# Altium project Dumber.PrjPCB
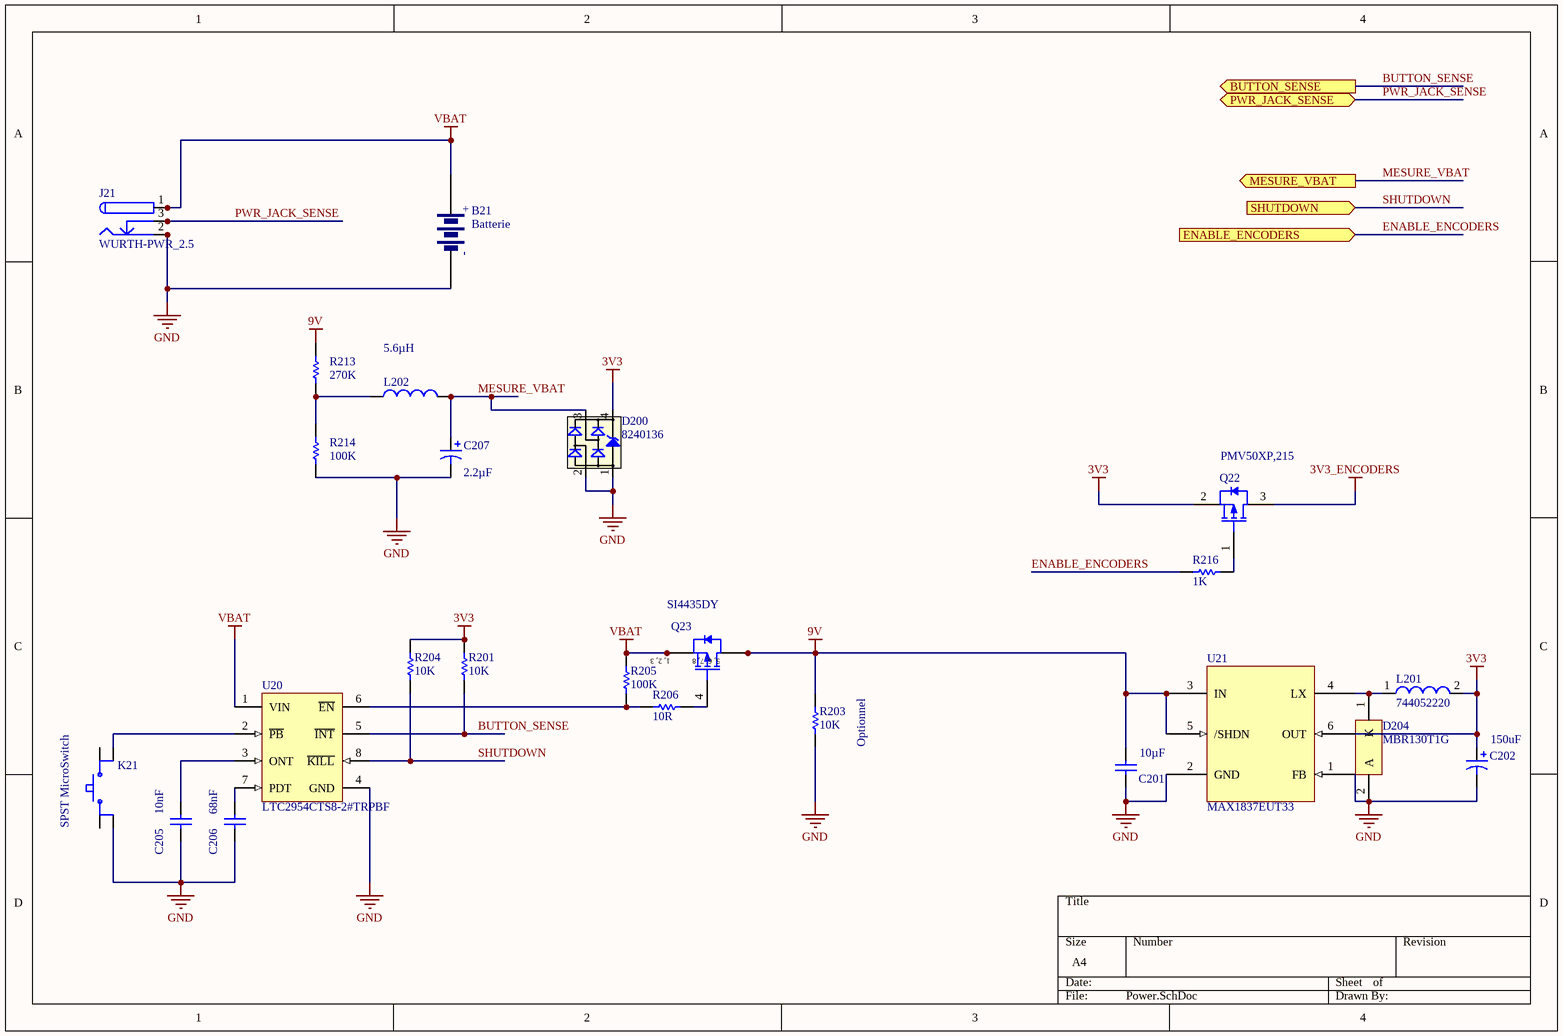
[diagram p0: Power.SchDoc]
2 sheets, 41 parts. Net scope: flat (ports and power ports of the same name join across sheets).
Board file: Dumber.PcbDoc
Sheets:
  Power.SchDoc
  cpu.SchDoc

## Sheet Power.SchDoc
size A4

### Parts
B21  Batterie  [batterie]
C201  value 10µF  [CAPC1206(3216)100_L]  (hidden comment: CAP 10µF)
C202  value 150uF  [B]  (hidden comment: CAP 150µF)
C205  value 10nF  [CAPC1206(3216)170_L]  (hidden comment: CAP 10nf)
C206  value 68nF  [CAPC1206(3216)170_L]  (hidden comment: CAP 68nF)
C207  value 2.2µF  [B]  (hidden comment: T491B)
D200  8240136  [SOT143-4L]
D204  MBR130T1G  [ONSC-SOD-123-2-425-04_V]
J21  WURTH-PWR_2.5  [Wurth_2.5]
K21  SPST MicroSwitch  [SPST_MicroSwitch]
L201  744052220  [WE-TPC-5818-L]
L202  value 5.6µH  [1812]  (hidden comment: Inductor)
Q22  PMV50XP,215  [NXP-SOT23_N]
Q23  SI4435DY  [SO-8_N]
R201  10K  [RESC1206(3216)_M]
R203  10K  [RESC1206(3216)_M]
R204  value 10K  [RESC1206(3216)_M]  (hidden comment: 100K)
R205  value 100K  [RESC1206(3216)_M]  (hidden comment: 270K)
R206  value 10R  [RESC1206(3216)_M]  (hidden comment: 270K)
R213  value 270K  [RESC0805(2012)_M]  (hidden comment: 270K 5% 0805(2012))
R214  100K  [RESC1206(3216)_M]
R216  1K  [RESC1206(3216)_M]
U20  LTC2954CTS8-2#TRPBF  [LT-TS8-8-TSOT-23_V]
U21  MAX1837EUT33  [SOT23-6]

### Ports
BUTTON_SENSE (out), ENABLE_ENCODERS (in), MESURE_VBAT (out), PWR_JACK_SENSE, SHUTDOWN (in)

### Nets
3V3: C202.1 D200.4(VDD) L201.2 Q22.2(S) R201.1 R204.1 U21.6(OUT)
3V3_ENCODERS: Q22.3(D)
9V: C201.2 Q23.5(D) Q23.6(D) Q23.7(D) Q23.8(D) R203.1 R213.2 U21.3(IN) U21.5(/SHDN)
GND: B21.V- C201.1 C202.2 C205.1 C206.1 C207.2 D200.1(GND) D200.2(I/O1) D204.2(A) J21.2 J21.2A J21.2B K21.2 R203.2 R214.2 U20.4(GND) U21.1(FB) U21.2(GND)
VBAT: B21.V+ J21.1 J21.1A J21.1B Q23.1(S) Q23.2(S) Q23.3(S) R205.1 U20.1(VIN)
BUTTON_SENSE: R201.2 U20.5(~{INT}) ; port BUTTON_SENSE
ENABLE_ENCODERS: R216.2 ; port ENABLE_ENCODERS
MESURE_VBAT: C207.1 D200.3(I/O2) L202.2 ; port MESURE_VBAT
PWR_JACK_SENSE: J21.3 J21.3A J21.3B ; port PWR_JACK_SENSE
SHUTDOWN: R204.2 U20.8(~{KILL}) ; port SHUTDOWN
NetC205_2: C205.2 U20.3(ONT)
NetC206_2: C206.2 U20.7(PDT)
NetD204_1: D204.1(K) L201.1 U21.4(LX)
NetK21_4: K21.4 U20.2(~{PB})
NetL202_1: L202.1 R213.1 R214.1
NetQ22_1: Q22.1(G) R216.1
NetQ23_4: Q23.4(G) R206.1
NetR205_2: R205.2 R206.2 U20.6(~{EN})

Not connected (* = marked no-connect by the designer): K21 1 3

### Notes on the sheet
- (near R203) Optionnel
- (in symbol Batterie) +; -
- (in symbol SI4435DY) 1, 2, 3; 5, 6, 7, 8

### Library data of the parts
B21 = Batterie: Keystone 1294; Distributeur: Radiospares: 172-5845 / Farnell: 1650674
C201 = CMP-1037-01131-1: CAP 10µF 25V ±10% 1206 (3216 Metric) Thickness 1mm SMD; Case-EIA: 1206; Tolerance: Â±10%; Case-Metric: 3216; Max Thickness: 1 mm; Technology: SMT; Rated Voltage: 25 V; Distributeur: Farnell : 2497120
C202 = 194D225X0015B2: CAP Tantalum, Body B, 150µF / 6.3V; Note: See Data Sheet for full range of components; Published: 19-Mar-2004; DatasheetDocument: 05-Jul-2002; PackageReference: B; Publisher: Altium Limited; ComponentLink1Description: Manufacturer Link; ComponentLink1URL: http://www.vishay.com/; ComponentLink2Description: Datasheet; ComponentLink2URL: http://www.vishay.com/docs/40000/194d.pdf; Distributeur: Farnell : 2491485
C205 C206 = CMP-1037-04201-1: CAP 100nF 50V ±10% 1206 (3216 Metric) Thickness 1.7mm SMD; Case-Metric: 3216; Tolerance: Â±10%; Case-EIA: 1206; Max Thickness: 1.7 mm; Rated Voltage: 50 V; Technology: SMT
  C205: Distributeur: Farnell : 1856586
  C206: Distributeur: Farnell : 2497117
C207 = T491B: Solid Tantalum Chip Capacitor, Standard T491 Series - Industrial Grade; Published: 17-Jul-2002; LatestRevisionDate: 19-Mar-2004; LatestRevisionNote: Silkscreen dimensions re-sized.; DatasheetDocument: Mar-2001; PackageDocument: Mar-2001; PackageReference: B; Publisher: Altium Limited; Code_JEITA: 3528-21; ComponentLink1Description: Manufacturer Link; ComponentLink1URL: http://www.kemet.com/; ComponentLink2Description: Datasheet; ComponentLink2URL: http://www.kemet.com/kemet/web/homepage/kechome.nsf/vapubfilesname/F3102TA.pdf/$file/F3102TA.pdf
D200 = CMP-1486-00002-1: TVS Diode WE-TVS-HS, VRWM=3.3V; Manufacturer: Wuerth Elektronik; Reverse Stand Off Voltage: 3.3V; PartNumber: 8240136; ComponentLink1Description: Manufacturer URL; PackageReference: SOT143-4L; ComponentLink1URL: http://www.we-online.com; ComponentLink2Description: Datasheet; ComponentLink2URL: http://katalog.we-online.de/kataloge/eisos/media/pdf/8240136.pdf
D204 = CMP-1055-00423-1: Schottky Power Rectifier, 2-Pin SOD-123, Pb-Free, Tape and Reel; Manufacturer: On Semiconductor; IFSM Max (A): 5.5; Configuration: Single; Mounting Technology: Surface Mount; ComponentLink3Description: Package Specification; PartNumber: MBR130T1G; PackageDescription: 2-Pin SOD, Body 1.6 x 2.69 mm; ComponentLink2Description: Datasheet; ComponentLink1Description: Manufacturer URL; Packing: Tape and Reel; PackageVersion: Rev. G, 10/2009; DatasheetVersion: Rev. 4; ComponentLink1URL: http://www.onsemi.com/; ComponentLink2URL: http://www.onsemi.cn/pub_link/Collateral/MBR130T1-D.PDF; PackageReference: SOD-123-2-425-04; ComponentLink3URL: http://www.onsemi.com/pub_link/Collateral/425-04.PDF; RoHS: TRUE; Distributeur: Farnell : 1431045
J21 = WURTH-PWR_2.5: Low Voltage Power Supply Connector; Published: 17-Dec-2003; DatasheetDocument: 09-May-2002; Publisher: Altium Limited; ComponentLink1Description: Manufacturer Link; ComponentLink1URL: http://domino.kycon.com/internet/Products.html; Distributeur: Farnell : 2472153
K21 = SPST MicroSwitch: SPST - MicroSwitch; Distributeur: Farnell: 2435161
L201 = CMP-0227-00400-1: SMD Shielded Tiny Power Inductor WE-TPC, L = 22.0 µH; Inductance: 22.0 ÂµH; DatasheetVersion: ver 7, Aug-2010; PackageReference: WE-TPC-5818-L; ComponentLink1URL: http://www.we-online.com; ComponentLink1Description: Manufacturer Link; ComponentLink2Description: Datasheet; PackageVersion: 2010; ComponentLink2URL: http://www.we-online.de/katalog/media/pdf/744052220.pdf; PackageDescription: SMD Inductor, 2-Leads, Body 5.8 x 5.8 mm; Distributeur: Farnell : 1635855
L202 = Inductor: Inductor SMD; Code_IEC: 1005; Published: 8-Jun-2000; LatestRevisionDate: 29-May-2009; LatestRevisionNote: IPC-7351 Footprint Added.; PackageReference: 0402-A; Publisher: Altium Limited; PackageDescription: Chip Inductor; Code_JEITA: 0402
Q22 = CMP-1258-00162-1: Single P-Channel Trench MOSFET, -20 V, -55 to 150 degC, 3-Pin SOT23, Tape and Reel; PartNumber: PMV65XP,215; Manufacturer: NXP Semiconductors; Ciss [typ] (pF): 744; Channel Type: P; Packing: Tape & Reel; Coss [typ] (pF): 65; VGSth [typ] (V): -0.65; ComponentLink3URL: http://www.nxp.com/documents/outline_drawing/sot023_po.pdf; Mounting Technology: Surface Mount; Code_JEDEC: TO-236AB; VDS [max] (V): -20; ComponentLink1URL: http://www.nxp.com/; ComponentLink2Description: Datasheet; ComponentLink3Description: Package Specification; PackageReference: SOT23; PackageVersion: 06-03-16, 03/2006; ComponentLink2URL: http://www.nxp.com/documents/data_sheet/PMV65XP.pdf; PackageDescription: 3-Pin Small Outline Transistor Package, Body 2.9 x 1.3 mm, Pitch 0.95 mm; DatasheetVersion: Rev. 2; ComponentLink1Description: Manufacturer URL; Distributeur: Farnell : 2498580
Q23 = SI4435DY: P-Channel 30V (D-S) Rated  MOSFET; Published: 8-Jun-2000; LatestRevisionDate: 13-Apr-2006; LatestRevisionNote: IPC-7351 Footprint Added.; DatasheetVersion: 6-Oct-1997; PackageVersion: Aug-1998; PackageReference: SO-8; Publisher: Altium Limited; PackageDescription: 8-Pin Small Outline Integrated Circuit 1.27 mm Pitch; ComponentLink1Description: Manufacturer Link; ComponentLink1URL: http://www.vishay.com/; ComponentLink2Description: Datasheet; ComponentLink2URL: http://www.vishay.com/docs/70149/70149.pdf
R201 R203-R206 R214 R216 = CMP-1014-00098-1: 10K 0.25W 5% 1206 (3216 Metric)  SMD; Case-Metric: 3216; Case-EIA: 1206; Power: 0.25 W; Tolerance: 5 %; Technology: SMT
  R201 R203: Value: 10K
  R214: Value: 100K
  R216: Value: 1K
R213 = CMP-1013-00132-1: 270K 0.125W 5% 0805 (2012 Metric)  SMD; Case-EIA: 0805; Case-Metric: 2012; Tolerance: 5 %; Technology: SMT; Power: 0.125 W
U20 = CMP-0482-01492-1: Pushbutton On / Off  Controller with µP Interrupt, 8-pin SOT23 (TS8-8), 0 to 70 degC, Pb-Free, Tape and Reel; Manufacturer: Linear Technology; Number of Supplies(#): 1; PackageDescription: 8-Pin Plastic TSOT-23, Body 2.9 x 1.63 mm, Pitch 0.65 mm; DatasheetVersion: Rev. B; ComponentLink1Description: Manufacturer URL; ComponentLink3Description: Package Specification; PackageVersion: Rev. A, 08/2010; RoHS: TRUE; ComponentLink2Description: Datasheet; Code_JEDEC: MO-193; ComponentLink2URL: http://cds.linear.com/docs/en/datasheet/2954fb.pdf; ComponentLink1URL: http://www.linear.com/; Packing: Tape and Reel; ComponentLink3URL: http://cds.linear.com/docs/en/packaging/SOT_8_05-08-1637.pdf; PackageReference: TS8-8; Mounting Technology: Surface Mount; PartNumber: LTC2954CTS8-2#TRPBF
U21 = MAX1837: Distributeur: Farnell : 2514159

## Sheet cpu.SchDoc
size A4
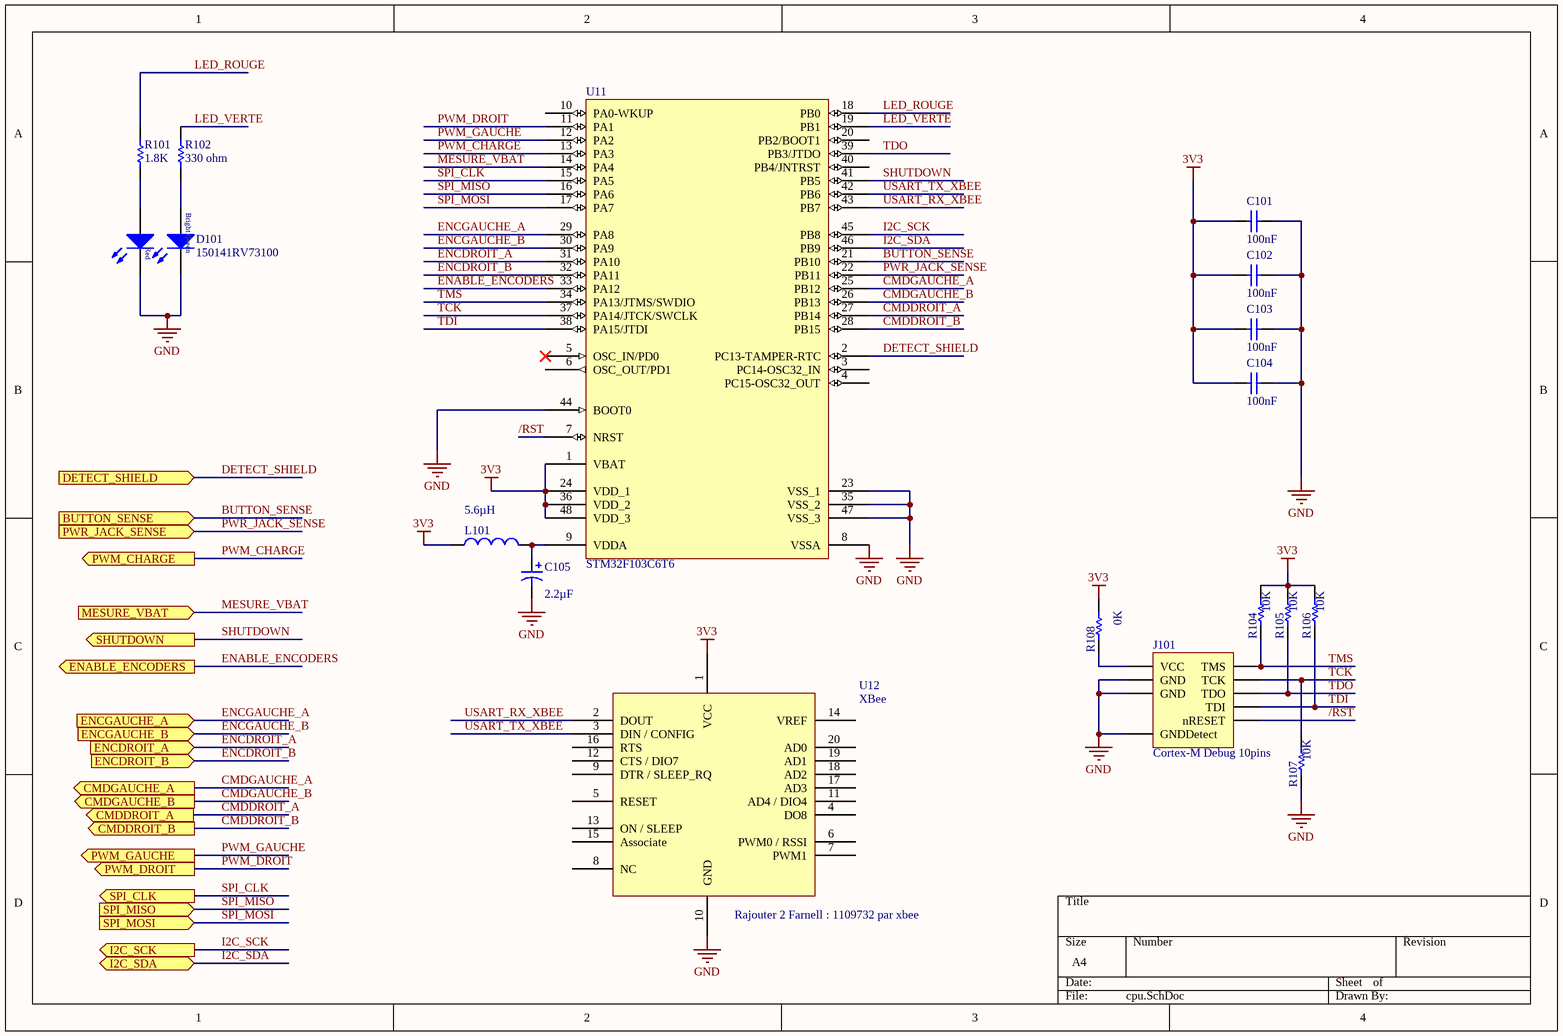
[diagram p1: cpu.SchDoc]

### Parts
C101  value 100nF  [CAPC1206(3216)170_L]  (hidden comment: CAP 100nF)
C102  value 100nF  [CAPC1206(3216)170_L]  (hidden comment: CAP 100nF)
C103  value 100nF  [CAPC1206(3216)170_L]  (hidden comment: CAP 100nF)
C104  value 100nF  [CAPC1206(3216)170_L]  (hidden comment: CAP 100nF)
C105  value 2.2µF  [B]  (hidden comment: T491B)
D101  150141RV73100  [3528_A]
J101  Cortex-M Debug 10pins  [Cortex M Debug]
L101  value 5.6µH  [1812]  (hidden comment: Inductor)
R101  value 1.8K  [RESC0805(2012)_N]  (hidden comment: 1K8 5% 0805(2012))
R102  value 330 ohm  [RESC0805(2012)_L]  (hidden comment: 330R 5% 0805(2012))
R104  10K  [RESC1206(3216)_M]
R105  10K  [RESC1206(3216)_M]
R106  10K  [RESC1206(3216)_M]
R107  10K  [RESC1206(3216)_M]
R108  value 0K  [RESC1206(3216)_M]  (hidden comment: 10K)
U11  STM32F103C6T6  [LQFP48_N]
U12  XBee  [XBee]

### Ports
BUTTON_SENSE (in), CMDDROIT_A (out), CMDDROIT_B (out), CMDGAUCHE_A (out), CMDGAUCHE_B (out), DETECT_SHIELD (in), ENABLE_ENCODERS (out), ENCDROIT_A (in), ENCDROIT_B (in), ENCGAUCHE_A (in), ENCGAUCHE_B (in), I2C_SCK (out), I2C_SDA (bidir), MESURE_VBAT (in), PWM_CHARGE (out), PWM_DROIT (out), PWM_GAUCHE (out), PWR_JACK_SENSE (in), SHUTDOWN (out), SPI_CLK (out), SPI_MISO (in), SPI_MOSI (in)

### Nets
3V3: C101.2 C102.2 C103.2 C104.2 L101.1 R104.2 R105.2 R106.2 R108.2 U11.1(VBAT) U11.24(VDD_1) U11.36(VDD_2) U11.48(VDD_3) U12.1(VCC)
GND: C101.1 C102.1 C103.1 C104.1 C105.2 D101.3(C) D101.4(C) J101.3(GND) J101.5(GND) J101.9(GNDDetect) R107.1 U11.8(VSSA) U11.23(VSS_1) U11.35(VSS_2) U11.44(BOOT0) U11.47(VSS_3) U12.10(GND)
/RST: J101.10(nRESET) U11.7(NRST)
BUTTON_SENSE: U11.21(PB10) ; port BUTTON_SENSE
CMDDROIT_A: U11.27(PB14) ; port CMDDROIT_A
CMDDROIT_B: U11.28(PB15) ; port CMDDROIT_B
CMDGAUCHE_A: U11.25(PB12) ; port CMDGAUCHE_A
CMDGAUCHE_B: U11.26(PB13) ; port CMDGAUCHE_B
DETECT_SHIELD: U11.2(PC13-TAMPER-RTC) ; port DETECT_SHIELD
ENABLE_ENCODERS: U11.33(PA12) ; port ENABLE_ENCODERS
ENCDROIT_A: U11.31(PA10) ; port ENCDROIT_A
ENCDROIT_B: U11.32(PA11) ; port ENCDROIT_B
ENCGAUCHE_A: U11.29(PA8) ; port ENCGAUCHE_A
ENCGAUCHE_B: U11.30(PA9) ; port ENCGAUCHE_B
I2C_SCK: U11.45(PB8) ; port I2C_SCK
I2C_SDA: U11.46(PB9) ; port I2C_SDA
LED_ROUGE: R101.2 U11.18(PB0)
LED_VERTE: R102.2 U11.19(PB1)
MESURE_VBAT: U11.14(PA4) ; port MESURE_VBAT
PWM_CHARGE: U11.13(PA3) ; port PWM_CHARGE
PWM_DROIT: U11.11(PA1) ; port PWM_DROIT
PWM_GAUCHE: U11.12(PA2) ; port PWM_GAUCHE
PWR_JACK_SENSE: U11.22(PB11) ; port PWR_JACK_SENSE
SHUTDOWN: U11.41(PB5) ; port SHUTDOWN
SPI_CLK: U11.15(PA5) ; port SPI_CLK
SPI_MISO: U11.16(PA6) ; port SPI_MISO
SPI_MOSI: U11.17(PA7) ; port SPI_MOSI
TCK: J101.4(TCK) R107.2 U11.37(PA14/JTCK/SWCLK)
TDI: J101.8(TDI) R106.1 U11.38(PA15/JTDI)
TDO: J101.6(TDO) R105.1 U11.39(PB3/JTDO)
TMS: J101.2(TMS) R104.1 U11.34(PA13/JTMS/SWDIO)
USART_RX_XBEE: U11.43(PB7) U12.2(DOUT)
USART_TX_XBEE: U11.42(PB6) U12.3(DIN_/_CONFIG)
NetC105_1: C105.1 L101.2 U11.9(VDDA)
NetD101_1: D101.1(A) R101.1
NetD101_2: D101.2(A) R102.1
NetJ101_1: J101.1(VCC) R108.1

Not connected (* = marked no-connect by the designer): U11 3(PC14-OSC32_IN) 4(PC15-OSC32_OUT) 5(OSC_IN/PD0)* 6(OSC_OUT/PD1) 10(PA0-WKUP) 20(PB2/BOOT1) 40(PB4/JNTRST); U12 4(DO8) 5(RESET) 6(PWM0_/_RSSI) 7(PWM1) 8(NC) 9(DTR_/_SLEEP_RQ) 11(AD4_/_DIO4) 12(CTS_/_DIO7) 13(ON_/_SLEEP) 14(VREF) 15(Associate) 16(RTS) 17(AD3) 18(AD2) 19(AD1) 20(AD0)

### Notes on the sheet
- (near U12) Rajouter 2 Farnell : 1109732 par xbee
- (in symbol CMP-1430-00001-1) Bright Green; Red

### Library data of the parts
C101-C104 = CMP-1037-04201-1: as C205 on sheet Power; Max Thickness: 1.7 mm; Rated Voltage: 50 V; Technology: SMT
C105 = T491B: as C207 on sheet Power; Published: 17-Jul-2002; LatestRevisionDate: 19-Mar-2004; LatestRevisionNote: Silkscreen dimensions re-sized.; DatasheetDocument: Mar-2001; PackageDocument: Mar-2001; PackageReference: B; Publisher: Altium Limited; Code_JEITA: 3528-21; ComponentLink1Description: Manufacturer Link; ComponentLink1URL: http://www.kemet.com/; ComponentLink2Description: Datasheet; ComponentLink2URL: http://www.kemet.com/kemet/web/homepage/kechome.nsf/vapubfilesname/F3102TA.pdf/$file/F3102TA.pdf
D101 = CMP-1430-00001-1: SMD Bi-Color Top LED, WL-SBTW, Red & Bright Green; Manufacturer: Wuerth Elektronik; PartNumber: 150141RV73100; ComponentLink1Description: Manufacturer URL; ComponentLink2Description: Datasheet; ComponentLink2URL: http://katalog.we-online.com/led/datasheet/150141RV73100.pdf; Color: Red & Bright Green; ComponentLink1URL: http://www.we-online.com; PackageReference: 3528_A; Distributeur: Farnell : 2322113
L101 = Inductor: Inductor SMD; Code_IEC: 1005; Published: 8-Jun-2000; LatestRevisionDate: 29-May-2009; LatestRevisionNote: IPC-7351 Footprint Added.; PackageReference: 0402-A; Publisher: Altium Limited; PackageDescription: Chip Inductor; Code_JEITA: 0402
R101 = CMP-1013-00080-1: 1K8 0.125W 5% 0805 (2012 Metric)  SMD; Case-EIA: 0805; Case-Metric: 2012; Technology: SMT; Power: 0.125 W; Tolerance: 5 %
R102 = CMP-1013-00062-1: 330R 0.125W 5% 0805 (2012 Metric)  SMD; Case-EIA: 0805; Case-Metric: 2012; Tolerance: 5 %; Power: 0.125 W; Technology: SMT
R104-R108 = CMP-1014-00098-1: as R201 on sheet Power; Power: 0.25 W; Tolerance: 5 %; Technology: SMT
  R104-R107: Value: 10K
U11 = STM32F103C6T6: STM32 ARM-based 32-bit MCU with 32 Kbytes Flash, 48-pin LQFP, Industrial Temperature; Published: 30-May-2008; DatasheetVersion: rev6, Mar-2008; PackageVersion: Mar-2008; PackageReference: LQFP48; Publisher: Altium Limited; PackageDescription: 48-Pin Low-Profile Quad Flat Pack, 7 x 7 mm Body, 0.5 mm Pitch (LQFP48); ComponentLink1Description: Manufacturer Link; ComponentLink1URL: www.st.com/stm32; ComponentLink2Description: Datasheet; ComponentLink2URL: http://www.st.com/stonline/products/literature/ds/13587.pdf; Distributeur: Farnell : 1972391
U12 = XBee: Xbee RF transceiver from Digi
J101 = Cortex-M Debug 10pins: Distributeur: Farnell : 1667729

## Nets that join several sheets
3V3: Power (7 pins), cpu (14 pins)
GND: Power (18 pins), cpu (17 pins)
BUTTON_SENSE: Power (R201.2 U20.5), cpu (U11.21)
ENABLE_ENCODERS: Power (R216.2), cpu (U11.33)
MESURE_VBAT: Power (C207.1 D200.3 L202.2), cpu (U11.14)
PWR_JACK_SENSE: Power (J21.3 J21.3A J21.3B), cpu (U11.22)
SHUTDOWN: Power (R204.2 U20.8), cpu (U11.41)